# Altium schematic sheet driver.SchDoc
size 290 x 209 mm
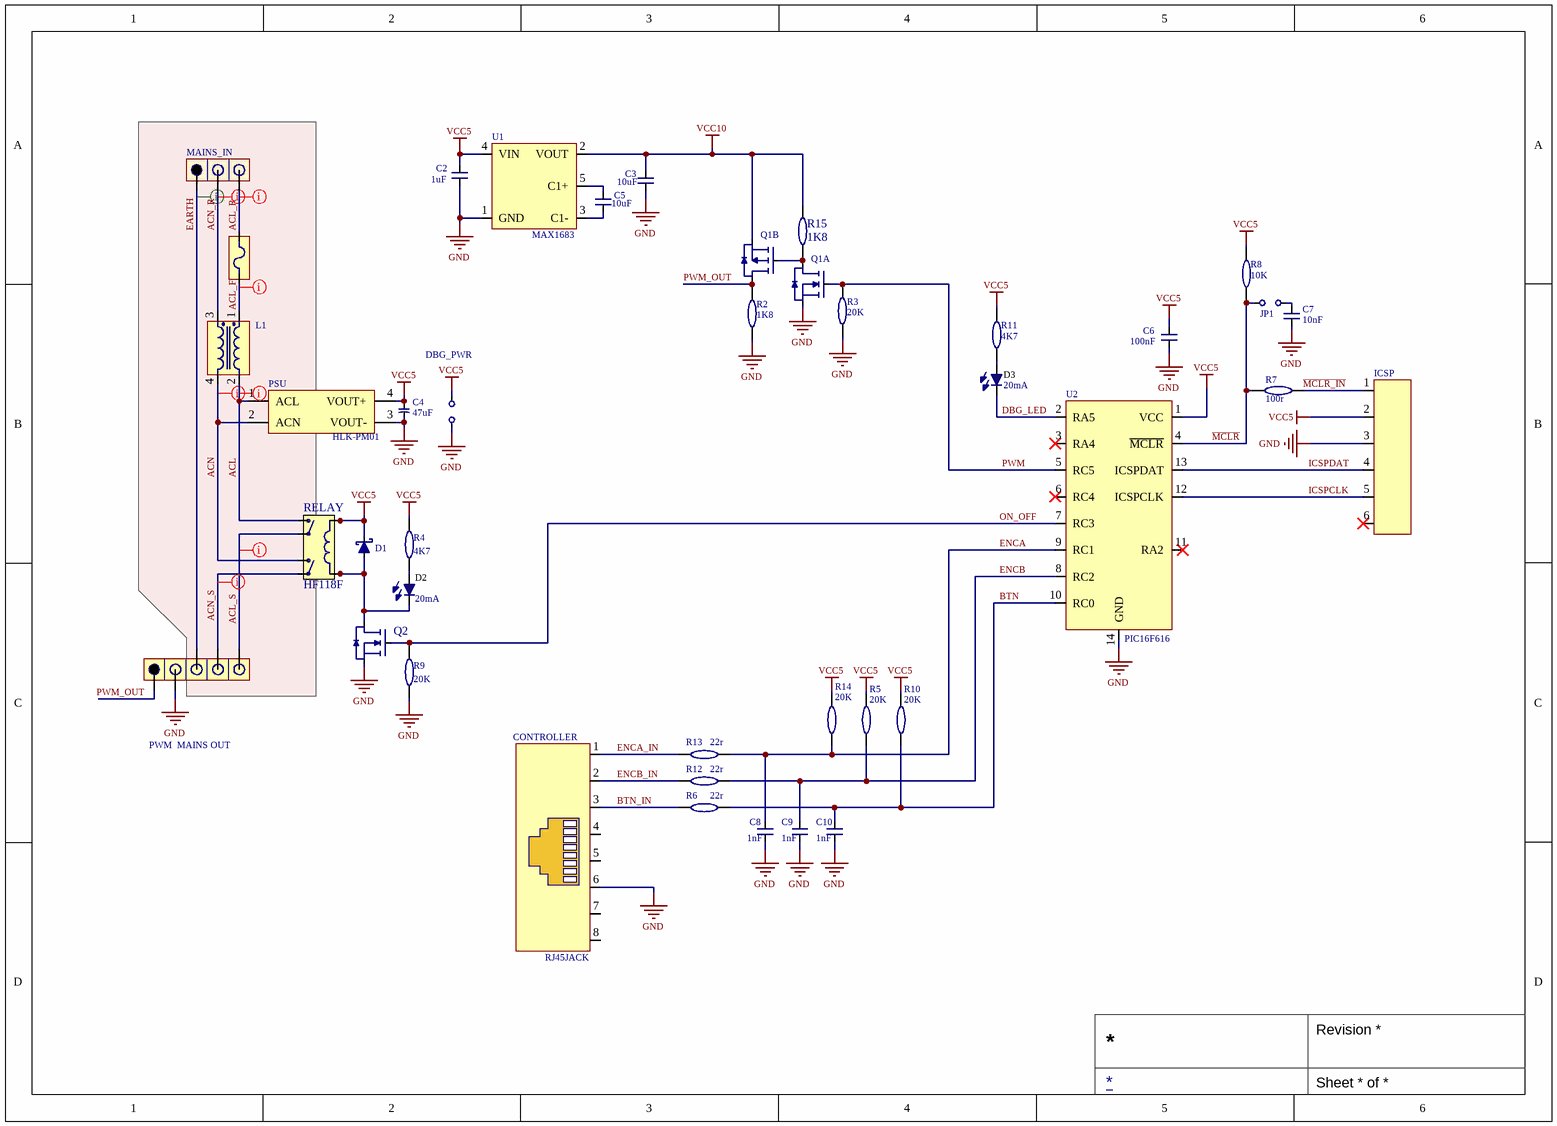
[diagram p0: driver.SchDoc]

## Parts
C2  1uF  [CAP 0805_2012]
C3  10uF  [CAP 0805_2012]
C4  47uF  [CAPMP7343X11L]
C5  10uF  [CAP 0805_2012]
C6  100nF  [CAP 0805_2012]
C7  10nF  [CAP 0603_1608]
C8  1nF  [CAP 0603_1608]
C9  1nF  [CAP 0603_1608]
C10  1nF  [CAP 0603_1608]
CONTROLLER  RJ45JACK  [RJHSE-5080]
D1  DSF05S30U  [SODFL250X100-2L]  (value not drawn)
D2  20mA  [SMT_LED 0603_RED]
D3  20mA  [SMT_LED 0603_RED]
DBG_PWR  JUMPER  [JUMPER]  (value not drawn)
FUSE_5A  520_102701  [BEL_FC-102-BRIGHT-TIN]  (value not drawn)
ICSP  HEADER6  [HEADER6]  (value not drawn)
JP1  JUMPER  [JUMPER]  (value not drawn)
L1  CHOKE  [SC-40-200]  (value not drawn)
MAINS_IN  TERMINAL3  [TERMINAL_BLOCK_3]  (value not drawn)
PSU  HLK-PM01  [HLK-PM01]
PWM_MAINS_OUT  TERMINAL5  [TERMINAL_BLOCK_5]  (value not drawn)
Q1  MOSFET-NP  [DMG6601LVT]  (value not drawn)  (parts A,B of 2)
Q2  MOSFET-N  [SOT23]  (value not drawn)
R2  1K8  [RES 0603_1608]
R3  20K  [RES 0603_1608]
R4  4K7  [RES 0603_1608]
R5  20K  [RES 0603_1608]
R6  22r  [RES 0603_1608]
R7  100r  [RES 0603_1608]
R8  10K  [RES 0603_1608]
R9  20K  [RES 0603_1608]
R10  20K  [RES 0603_1608]
R11  4K7  [RES 0603_1608]
R12  22r  [RES 0603_1608]
R13  22r  [RES 0603_1608]
R14  20K  [RES 0603_1608]
R15  1K8  [RES 0603_1608]
RELAY  HF118F  [G5RL-1-E-HR]
U1  MAX1683  [SOT23-5]
U2  PIC16F616  [SOIC14]

## Nets
GND: C2.2(B) C3.2(B) C4.2(-) C6.2(B) C7.2(B) C8.2(B) C9.2(B) C10.2(B) CONTROLLER.6 DBG_PWR.2 ICSP.3 PSU.3(VOUT-) PWM_MAINS_OUT.2 Q1.SN Q2.S R2.2(B) R3.1(A) R9.1(A) U1.1(GND) U2.14(GND)
VCC5: C2.1(A) C4.1(+) C6.1(A) D1.1(C) DBG_PWR.1 ICSP.2 PSU.4(VOUT+) R4.2(B) R5.2(B) R8.1(A) R10.2(B) R11.2(B) R14.2(B) RELAY.2 U1.4(VIN) U2.1(VCC)
VCC10: C3.1(A) Q1.SP R15.2(B) U1.2(VOUT)
~{MCLR}: JP1.1 R7.1(A) R8.2(B) U2.4(~{MCLR})
~{MCLR_IN}: ICSP.1 R7.2(B)
ACL: L1.2 PSU.1(ACL) RELAY.5
ACL_F: FUSE_5A.2 L1.1
ACL_R: FUSE_5A.1 MAINS_IN.3
ACL_S: PWM_MAINS_OUT.5 RELAY.6
ACN: L1.4 PSU.2(ACN) RELAY.3
ACN_R: L1.3 MAINS_IN.2
ACN_S: PWM_MAINS_OUT.4 RELAY.4
BTN: C10.1(A) R6.2(B) R10.1(A) U2.10(RC0)
BTN_IN: CONTROLLER.3 R6.1(A)
DBG_LED: D3.1(CATHODE) U2.2(RA5)
EARTH: MAINS_IN.1 PWM_MAINS_OUT.3
ENCA: C8.1(A) R13.2(B) R14.1(A) U2.9(RC1)
ENCA_IN: CONTROLLER.1 R13.1(A)
ENCB: C9.1(A) R5.1(A) R12.2(B) U2.8(RC2)
ENCB_IN: CONTROLLER.2 R12.1(A)
ICSPCLK: ICSP.5 U2.12(ICSPCLK)
ICSPDAT: ICSP.4 U2.13(ICSPDAT)
ON_OFF: Q2.G R9.2(B) U2.7(RC3)
PWM: Q1.GN R3.2(B) U2.5(RC5)
PWM_OUT: PWM_MAINS_OUT.1 Q1.DP R2.1(A)
NetC5_1: C5.1(A) U1.5(C1+)
NetC5_2: C5.2(B) U1.3(C1-)
NetC7_1: C7.1(A) JP1.2
NetD1_2: D1.2(A) D2.1(CATHODE) Q2.D RELAY.1
NetD2_2: D2.2(ANODE) R4.1(A)
NetD3_2: D3.2(ANODE) R11.1(A)
NetQ1_DN: Q1.DN Q1.GP R15.1(A)

Not connected (* = marked no-connect by the designer): CONTROLLER 4 5 7 8; ICSP 6*; U2 3(RA4)* 6(RC4)* 11(RA2)*

## Layout directives
net class MAINS: ACL, ACL_F, ACL_R, ACL_S, ACN, ACN_R, ACN_S, EARTH

## Library data of the parts
C2 C3 C5-C10 = CAP_CERAMIC: Ceramic capacitor
  C2: Value: 1uF
  C3 C5: Value: 10uF
  C6: Value: 100nF
  C7: Value: 10nF
  C8-C10: Value: 1nF
C4 = EEFCS1A470R: Electrolytic Capacitor; TYPE: Polymer; Voltage: 6.3V; Vendor: Panasonic; Value: 47uF; MPN: EEFCS1A470R
D1 = DSF05S30U: Schottky Diode 20v 500mA; Alternate: CUS551V30
D2 D3 = LED: Value: 20mA; LCSC Part Number: *
FUSE_5A = 520_102701: 5x20 5A fuse speed F
MAINS_IN = TERMINAL3: 3 way terminal block
PSU = HLK-PM01: 5V PSU 0.6A
PWM_MAINS_OUT = TERMINAL5: 5 way terminal block
Q1 = MOSFET-NP: N/P Channel MOSFET; pin to pad: DN>6 DP>4 GN>1 GP>3 SN>5 SP>2; Manufacturer Part Number: DMC2400UV-13; LCSC Part Number: C500791
R2-R15 = RESISTOR: LCSC Part Number: *; Tolerance: *; Package: *; Power: *
  R2 R15: Value: 1K8
  R3 R5 R9 R10 R14: Value: 20K
  R4 R11: Value: 4K7
  R6 R12 R13: Value: 22r
  R7: Value: 100r
  R8: Value: 10K
RELAY = HF118F: 240V 10A Relay 5V
U1 = MAX1683: Charge Pump